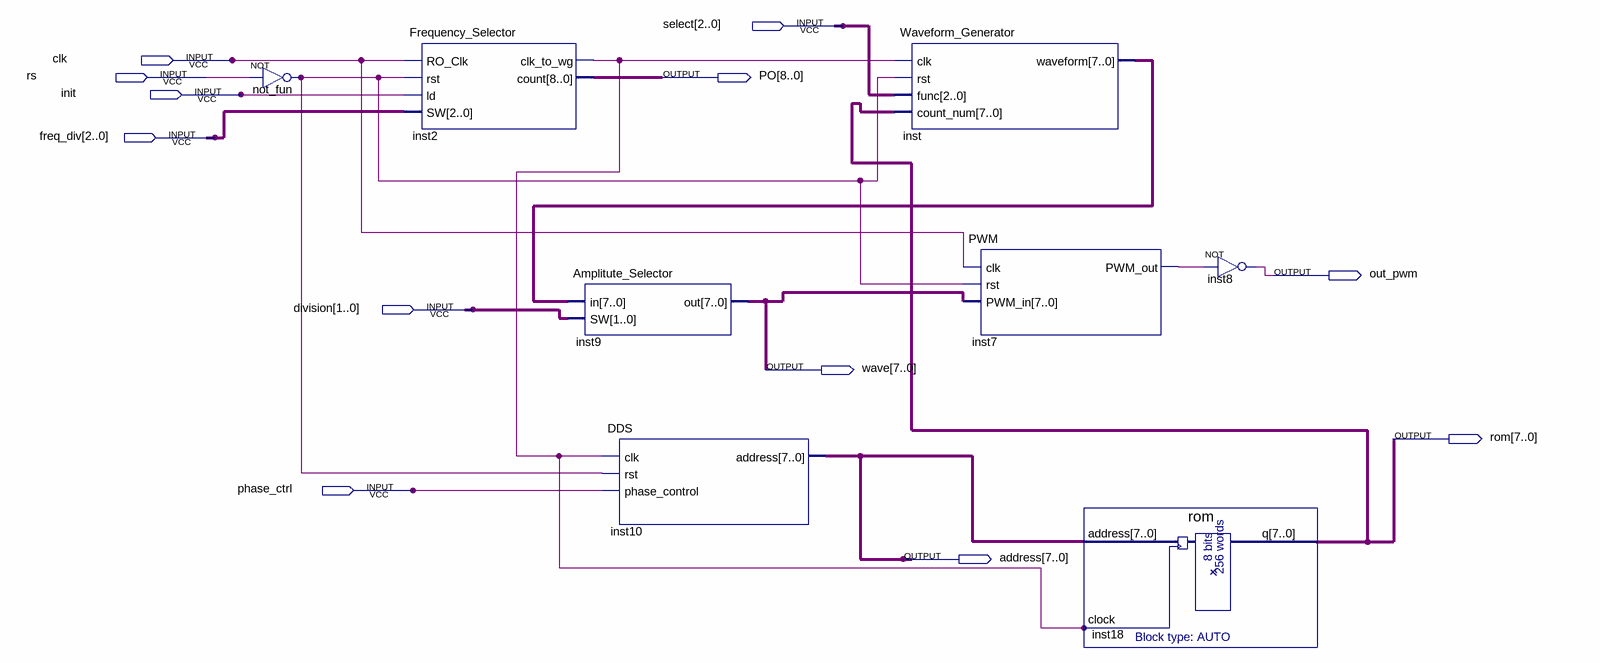
[diagram p0: schematic sheet]
// Quartus schematic DLDLab3_Diagram.bdf as structural Verilog: 8 symbols, 12 pins
module DLDLab3_Diagram (
  input  [2:0] select,
  input  clk,
  input  rs,
  input  init,
  input  [2:0] freq_div,
  input  [1:0] division,
  input  phase_ctrl,
  output [8:0] PO,
  output out_pwm,
  output [7:0] wave,
  output [7:0] rom,
  output [7:0] address
);

  wire inst2_clk_to_wg, inst7_pwm_out, not_fun_out;
  wire [7:0] inst_waveform;

  not not_fun (not_fun_out, rs);
  Frequency_Selector inst2 (
    .RO_Clk(clk), .rst(not_fun_out), .ld(init), .SW(freq_div), .clk_to_wg(inst2_clk_to_wg), .count(PO));
  Amplitute_Selector inst9 (.in(inst_waveform), .SW(division), .out(wave));
  DDS inst10 (.clk(inst2_clk_to_wg), .rst(not_fun_out), .phase_control(phase_ctrl), .address(address));
  Waveform_Generator inst (
    .clk(inst2_clk_to_wg), .rst(not_fun_out), .func(select), .count_num(rom), .waveform(inst_waveform));
  PWM inst7 (.clk(clk), .rst(not_fun_out), .PWM_in(wave), .PWM_out(inst7_pwm_out));
  rom inst18 (.address(address), .clock(inst2_clk_to_wg), .q(rom));
  not inst8 (out_pwm, inst7_pwm_out);
endmodule
